# Altium schematic sheet container_V1.SchDoc
size A3
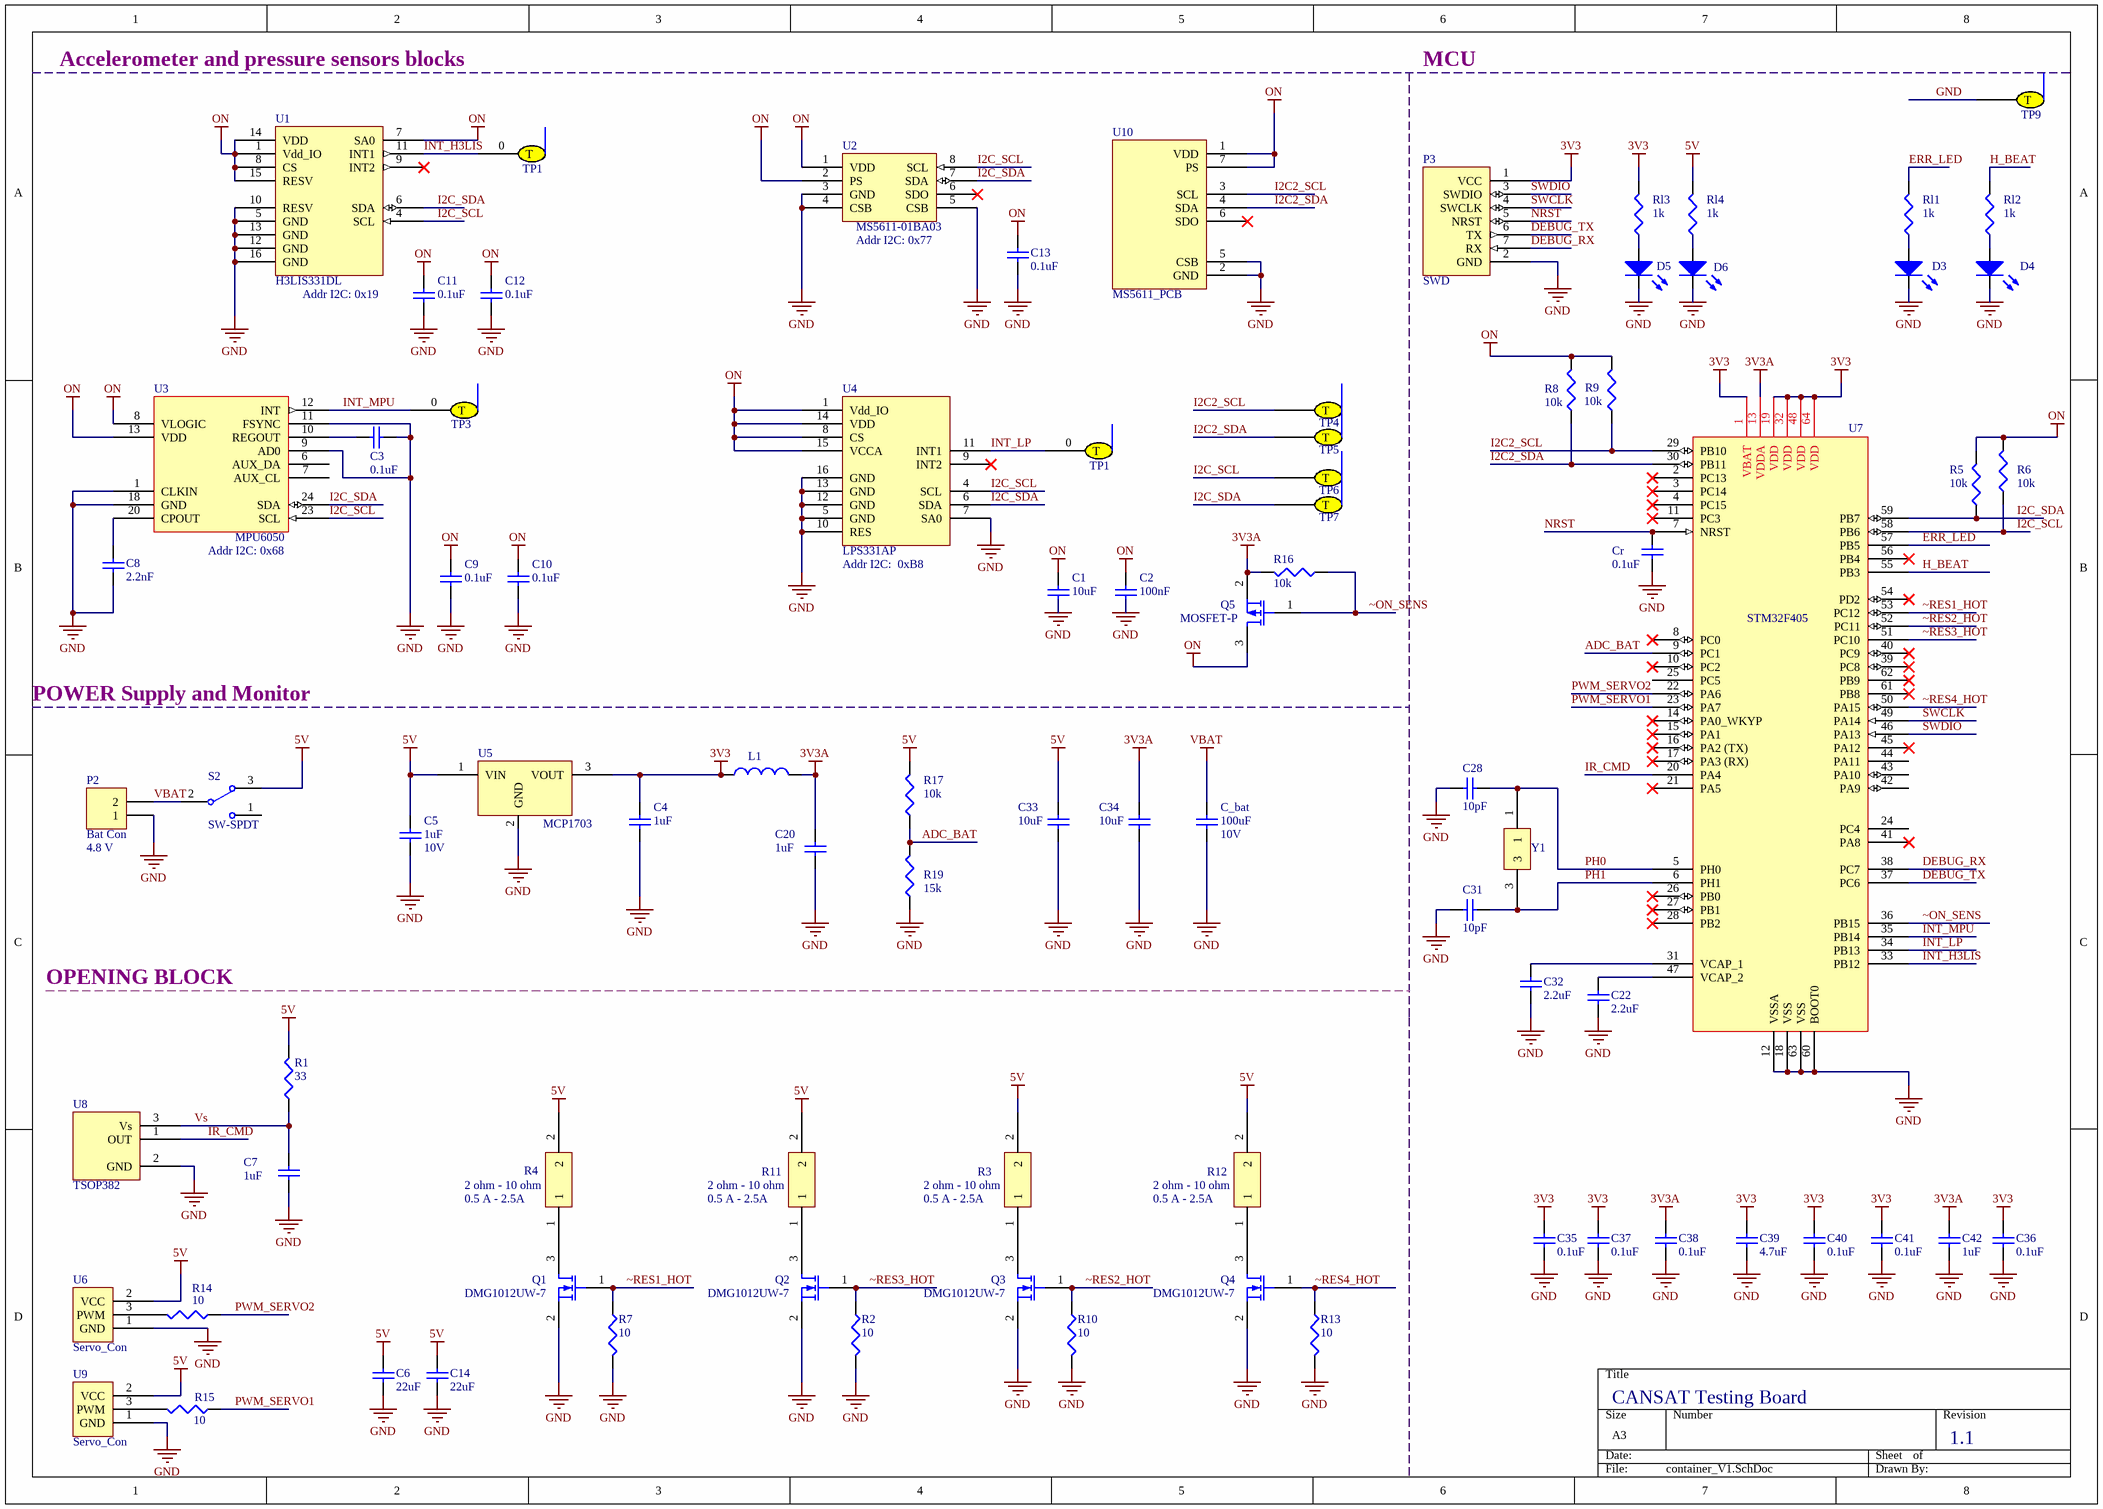
[diagram p0: container_V1.SchDoc]

## Parts
C1  value 10uF  [CAP_0603]  (hidden comment: Cap Semi)
C2  value 100nF  [CAP_0603]  (hidden comment: Cap Semi)
C3  value 0.1uF  [CAP_0603]  (hidden comment: Cap Semi)
C4  value 1uF  [CAP_0603]  (hidden comment: Cap Semi)
C5  value 1uF  [CAP_0603]  (hidden comment: Cap Semi)
C6  value 22uF  [CAP_0603]  (hidden comment: Cap Semi)
C7  value 1uF  [CAP_0603]  (hidden comment: Cap Semi)
C8  value 2.2nF  [CAP_0603]  (hidden comment: Cap Semi)
C9  value 0.1uF  [CAP_0603]  (hidden comment: Cap Semi)
C10  value 0.1uF  [CAP_0603]  (hidden comment: Cap Semi)
C11  value 0.1uF  [CAP_0603]  (hidden comment: Cap Semi)
C12  value 0.1uF  [CAP_0603]  (hidden comment: Cap Semi)
C13  value 0.1uF  [CAP_0603]  (hidden comment: Cap Semi)
C14  value 22uF  [CAP_0603]  (hidden comment: Cap Semi)
C20  value 1uF  [CAP_0603]  (hidden comment: Cap Semi)
C22  value 2.2uF  [CAP_0603]  (hidden comment: Cap Semi)
C28  value 10pF  [CAP_0603]  (hidden comment: Cap Semi)
C31  value 10pF  [CAP_0603]  (hidden comment: Cap Semi)
C32  value 2.2uF  [CAP_0603]  (hidden comment: Cap Semi)
C33  value 10uF  [CAP_0603]  (hidden comment: Cap Semi)
C34  value 10uF  [CAP_0603]  (hidden comment: Cap Semi)
C35  value 0.1uF  [CAP_0603]  (hidden comment: Cap Semi)
C36  value 0.1uF  [CAP_0603]  (hidden comment: Cap Semi)
C37  value 0.1uF  [CAP_0603]  (hidden comment: Cap Semi)
C38  value 0.1uF  [CAP_0603]  (hidden comment: Cap Semi)
C39  value 4.7uF  [CAP_0603]  (hidden comment: Cap Semi)
C40  value 0.1uF  [CAP_0603]  (hidden comment: Cap Semi)
C41  value 0.1uF  [CAP_0603]  (hidden comment: Cap Semi)
C42  value 1uF  [CAP_0603]  (hidden comment: Cap Semi)
C_bat  value 100uF  [CAP_0805]  (hidden comment: Cap Semi)
Cr  value 0.1uF  [CAP_0603]  (hidden comment: Cap Semi)
D3  LED2  [CAP_0603]  (value not drawn)
D4  LED2  [CAP_0603]  (value not drawn)
D5  LED2  [CAP_0603]  (value not drawn)
D6  LED2  [CAP_0603]  (value not drawn)
L1  Inductor  [INDUCTOR BLM]  (value not drawn)
P2  Bat Con  [BAT]
P3  SWD  [Header 7 SWD]
Q1  DMG1012UW-7  [N-MOS (SOT323)]
Q2  DMG1012UW-7  [N-MOS (SOT323)]
Q3  DMG1012UW-7  [N-MOS (SOT323)]
Q4  DMG1012UW-7  [N-MOS (SOT323)]
Q5  MOSFET-P  [P-MOS (SOT323)]
R1  value 33  [RES_0603]  (hidden comment: Res3)
R2  value 10  [RES_0603]  (hidden comment: Res3)
R3  2 ohm - 10 ohm  [Header 2 Jumper]
R4  2 ohm - 10 ohm  [Header 2 Jumper]
R5  value 10k  [RES_0603]  (hidden comment: Res3)
R6  value 10k  [RES_0603]  (hidden comment: Res3)
R7  value 10  [RES_0603]  (hidden comment: Res3)
R8  value 10k  [RES_0603]  (hidden comment: Res3)
R9  value 10k  [RES_0603]  (hidden comment: Res3)
R10  value 10  [RES_0603]  (hidden comment: Res3)
R11  2 ohm - 10 ohm  [JUMPER (Header 2)]
R12  2 ohm - 10 ohm  [Header 2 Jumper]
R13  value 10  [RES_0603]  (hidden comment: Res3)
R14  value 10  [RES_0603]  (hidden comment: Res3)
R15  value 10  [RES_0603]  (hidden comment: Res3)
R16  value 10k  [RES_0603]  (hidden comment: Res3)
R17  value 10k  [RES_0603]  (hidden comment: Res3)
R19  value 15k  [RES_0603]  (hidden comment: Res3)
Rl1  value 1k  [RES_0603]  (hidden comment: Res3)
Rl2  value 1k  [RES_0603]  (hidden comment: Res3)
Rl3  value 1k  [RES_0603]  (hidden comment: Res3)
Rl4  value 1k  [RES_0603]  (hidden comment: Res3)
S2  SW-SPDT  [Header 3 Servo]
TP1  TP1  [TP]
TP2  TP1  [TP]
TP3  TP3  [TP]
TP4  TP5  [TP]  (value not drawn)
TP5  TP5  [TP]  (value not drawn)
TP6  TP5  [TP]  (value not drawn)
TP7  TP5  [TP]  (value not drawn)
TP9  GND  [TP]  (value not drawn)
U1  H3LIS331DL  [H3LIS_HIGH_G]
U2  MS5611-01BA03  [MS561101BA03-50]
U3  MPU6050  [MPU6050]
U4  LPS331AP  [LPS331AP]
U5  MCP1703  [SOT230P700X180-4L25N]
U6  Servo_Con  [Header 3 Servo]
U7  STM32F405  [Microcontroller (LQFP)]
U8  TSOP382  [TO92254P530H965-3]
U9  Servo_Con  [Header 3 Servo]
U10  MS5611_PCB  [Header 7 SWD]
Y1  Crystal  [XTAL_TSX_3225]  (value not drawn)

## Nets
3V3: C4.1 C35.1 C36.1 C37.1 C39.1 C40.1 C41.1 L1.1 P3.1(VCC) Rl3.2 U5.3(VOUT) U7.1(VBAT) U7.19(VDD) U7.32(VDD) U7.48(VDD) U7.64(VDD)
3V3A: C20.2 C34.2 C38.1 C42.1 L1.2 Q5.2(S) R16.2 U7.13(VDDA)
5V: C5.1 C6.1 C14.1 C33.2 R1.2 R3.2 R4.2 R11.2 R12.2 R17.2 Rl4.2 S2.3 U5.1(VIN) U6.2(VCC) U9.2(VCC)
GND: C1.2 C2.2 C3.2 C4.2 C5.2 C6.2 C7.2 C8.2 C9.2 C10.2 C11.2 C12.2 C13.2 C14.2 C20.1 C22.2 C28.1 C31.1 C32.2 C33.1 C34.1 C35.2 C36.2 C37.2 C38.2 C39.2 C40.2 C41.2 C42.2 C_bat.2 Cr.2 D3.2(K) D4.2(K) D5.2(K) D6.2(K) P2.1 P3.2(GND) Q1.2(S) Q2.2(S) Q3.2(S) Q4.2(S) R2.2 R7.2 R10.2 R13.2 R19.1 TP9.0(T) U1.5(GND) U1.10(RESV) U1.12(GND) U1.13(GND) U1.16(GND) U2.3(GND) U2.4(CSB) U2.5(CSB) U3.1(CLKIN) U3.9(AD0) U3.11(FSYNC) U3.18(GND) U3.25(GND) U4.5(GND) U4.7(SA0) U4.10(RES) U4.12(GND) U4.13(GND) U4.16(GND) U5.2(GND) U6.1(GND) U7.12(VSSA) U7.18(VSS) U7.60(BOOT0) U7.63(VSS) U8.2(GND) U9.1(GND) U10.2(GND) U10.5(CSB) Y1.2 Y1.4
ON: C1.1 C2.1 C9.1 C10.1 C11.1 C12.1 C13.1 Q5.3(D) R5.2 R6.2 R8.2 R9.2 U1.1(Vdd_IO) U1.7(SA0) U1.8(CS) U1.14(VDD) U1.15(RESV) U2.1(VDD) U2.2(PS) U3.8(VLOGIC) U3.13(VDD) U4.1(Vdd_IO) U4.8(CS) U4.14(VDD) U4.15(VCCA) U10.1(VDD) U10.7(PS)
VBAT: C_bat.1 P2.2 S2.2
ADC_BAT: R17.1 R19.2 U7.9(PC1)
DEBUG_RX: P3.7(RX) U7.38(PC7)
DEBUG_TX: P3.6(TX) U7.37(PC6)
ERR_LED: Rl1.2 U7.57(PB5)
H_BEAT: Rl2.2 U7.55(PB3)
I2C2_SCL: R9.1 TP4.0(T) U7.29(PB10) U10.3(SCL)
I2C2_SDA: R8.1 TP5.0(T) U7.30(PB11) U10.4(SDA)
I2C_SCL: R6.1 TP6.0(T) U1.4(SCL) U2.8(SCL) U3.23(SCL) U4.4(SCL) U7.58(PB6)
I2C_SDA: R5.1 TP7.0(T) U1.6(SDA) U2.7(SDA) U3.24(SDA) U4.6(SDA) U7.59(PB7)
INT_H3LIS: TP1.0(T) U1.11(INT1) U7.33(PB12)
INT_LP: TP2.0(T) U4.11(INT1) U7.34(PB13)
INT_MPU: TP3.0(T) U3.12(INT) U7.35(PB14)
IR_CMD: U7.20(PA4) U8.1(OUT)
NRST: Cr.1 P3.5(NRST) U7.7(NRST)
PH0: C28.2 U7.5(PH0) Y1.1
PH1: C31.2 U7.6(PH1) Y1.3
PWM_SERVO1: R15.1 U7.23(PA7)
PWM_SERVO2: R14.1 U7.22(PA6)
SWCLK: P3.4(SWCLK) U7.49(PA14)
SWDIO: P3.3(SWDIO) U7.46(PA13)
Vs: C7.1 R1.1 U8.3(Vs)
~ON_SENS: Q5.1(G) R16.1 U7.36(PB15)
~RES1_HOT: Q1.1(G) R7.1 U7.53(PC12)
~RES2_HOT: Q3.1(G) R10.1 U7.52(PC11)
~RES3_HOT: Q2.1(G) R2.1 U7.51(PC10)
~RES4_HOT: Q4.1(G) R13.1 U7.50(PA15)
NetC3_1: C3.1 U3.10(REGOUT)
NetC8_1: C8.1 U3.20(CPOUT)
NetC22_1: C22.1 U7.47(VCAP_2)
NetC32_1: C32.1 U7.31(VCAP_1)
NetD3_1: D3.1(A) Rl1.1
NetD4_1: D4.1(A) Rl2.1
NetD5_1: D5.1(A) Rl3.1
NetD6_1: D6.1(A) Rl4.1
NetQ1_3: Q1.3(D) R4.1
NetQ2_3: Q2.3(D) R11.1
NetQ3_3: Q3.3(D) R3.1
NetQ4_3: Q4.3(D) R12.1
NetR14_2: R14.2 U6.3(PWM)
NetR15_2: R15.2 U9.3(PWM)

Not connected (* = marked no-connect by the designer): S2 1; U1 2(N/C) 3(N/C) 9(INT2)*; U2 6(SDO)*; U3 2(N/C) 3(N/C) 4(N/C) 5(N/C) 6(AUX_DA) 7(AUX_CL) 14(N/C) 15(N/C) 16(N/C) 17(N/C) 19(RESV) 21(RESV) 22(RESV); U4 2(NC) 3(NC) 9(INT2)*; U7 2(PC13)* 3(PC14)* 4(PC15)* 8(PC0)* 10(PC2)* 11(PC3)* 14(PA0_WKYP)* 15(PA1)* 16(PA2_(TX))* 17(PA3_(RX))* 21(PA5)* 24(PC4) 25(PC5) 26(PB0)* 27(PB1)* 28(PB2)* 39(PC8)* 40(PC9)* 41(PA8)* 42(PA9) 43(PA10) 44(PA11) 45(PA12)* 54(PD2)* 56(PB4)* 61(PB8)* 62(PB9)*; U10 6(SDO)*

## Notes on the sheet
- Accelerometer and pressure sensors blocks
- MCU
- (near U2) Addr I2C: 0x77
- Addr I2C: 0x19
- (near U3) Addr I2C: 0x68
- (near U4) Addr I2C:  0xB8
- POWER Supply and Monitor
- (near P2) 4.8 V
- (near C5) 10V
- (near C_bat) 10V
- OPENING BLOCK
- (near R4) 0.5 A - 2.5A
- (near R11) 0.5 A - 2.5A
- (near R3) 0.5 A - 2.5A
- (near R12) 0.5 A - 2.5A
- CANSAT Testing Board
- 1.1

## Library data of the parts
C1-C14 C20 C22 C28 C31-C42 C_bat Cr = Cap Semi: Capacitor (Semiconductor SIM Model); Published: 8-Jun-2000; LatestRevisionDate: 29-May-2009; LatestRevisionNote: IPC-7351 Footprint Added.; PackageReference: C1206; Publisher: Altium Limited; PackageDescription: Chip Capacitor
D3-D6 = LED2: Typical RED, GREEN, YELLOW, AMBER GaAs LED; Published: 8-Jun-2000; LatestRevisionDate: 17-Jul-2002; LatestRevisionNote: Re-released for DXP Platform.; PackageVersion: Feb-2002; PackageReference: 3.2X1.6X1.1; Publisher: Altium Limited; PackageDescription: SM LED; 2 Flat Leads
L1 = Inductor: Code_IEC: 1005; Value: BLM18KG601SN1D; Published: 8-Jun-2000; LatestRevisionDate: 29-May-2009; LatestRevisionNote: IPC-7351 Footprint Added.; PackageReference: 0402-A; Publisher: Altium Limited; PackageDescription: Chip Inductor; Code_JEITA: 0402
P2 = Header 2: Header, 2-Pin; LatestRevisionDate: 17-Jul-2002; LatestRevisionNote: Re-released for DXP Platform.; Publisher: Altium Limited
Q1-Q4 = MOSFET-N: N-Channel MOSFET; Published: 8-Jun-2000; LatestRevisionDate: 17-Jul-2002; LatestRevisionNote: Re-released for DXP Platform.; PackageVersion: 1995/1996; PackageReference: E3; Publisher: Altium Limited; PackageDescription: TO, Flat Index; 3 In-Line, Axial Leads; Body Dia. 4.6mm; Lead Dia. 0.5 mm (max)
Q5 = MOSFET-P: P-Channel MOSFET; Published: 8-Jun-2000; LatestRevisionDate: 17-Jul-2002; LatestRevisionNote: Re-released for DXP Platform.; PackageVersion: 1995/1996; PackageReference: E3; Publisher: Altium Limited; PackageDescription: TO, Flat Index; 3 In-Line, Axial Leads; Body Dia. 4.6mm; Lead Dia. 0.5 mm (max)
R1 R2 R5-R10 R13-R17 R19 Rl1-Rl4 = Res3: Resistor; Published: 8-Jun-2000; LatestRevisionDate: 29-May-2009; LatestRevisionNote: IPC-7351 Footprint Added.; PackageReference: J1-0603; Publisher: Altium Limited; PackageDescription: Chip Resistor
R3 R4 R11 R12 = Res_melting
S2 = SW-SPDT: SPDT Subminiature Toggle Switch, Right Angle Mounting, Vertical Actuation; Published: 24-Mar-1999; LatestRevisionDate: 17-Dec-2003; LatestRevisionNote: Schematic revised, PCB Footprint replaced.; DatasheetVersion: 05-Dec-2000; PackageReference: TL36WW15050; Publisher: Altium Limited; PackageDescription: Switch; 4 Leads; ComponentLink1Description: Manufacturer Link; ComponentLink1URL: http://www.apem.com
TP1-TP7 TP9 = TP
U1 = H3LIS331DL: High g accelerometer
U5 = LDO: URL: http://www.digikey.com/product-detail/en/microchip-technology/MCP1700T-3302E%2FTT/MCP1700T3302ETTCT-ND/652677